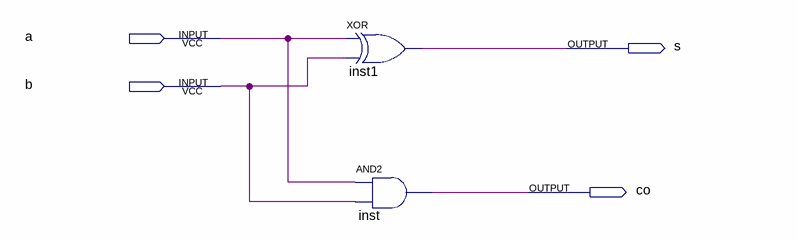
[diagram p0: schematic sheet]
// Quartus schematic h_add.bdf as structural Verilog: 2 symbols, 4 pins
module h_add (
  input  a,
  input  b,
  output s,
  output co
);

  xor inst1 (s, a, b);
  and inst (co, a, b);
endmodule
